# EAGLE schematic ece411_t2_schematic (EAGLE 9.5.2)
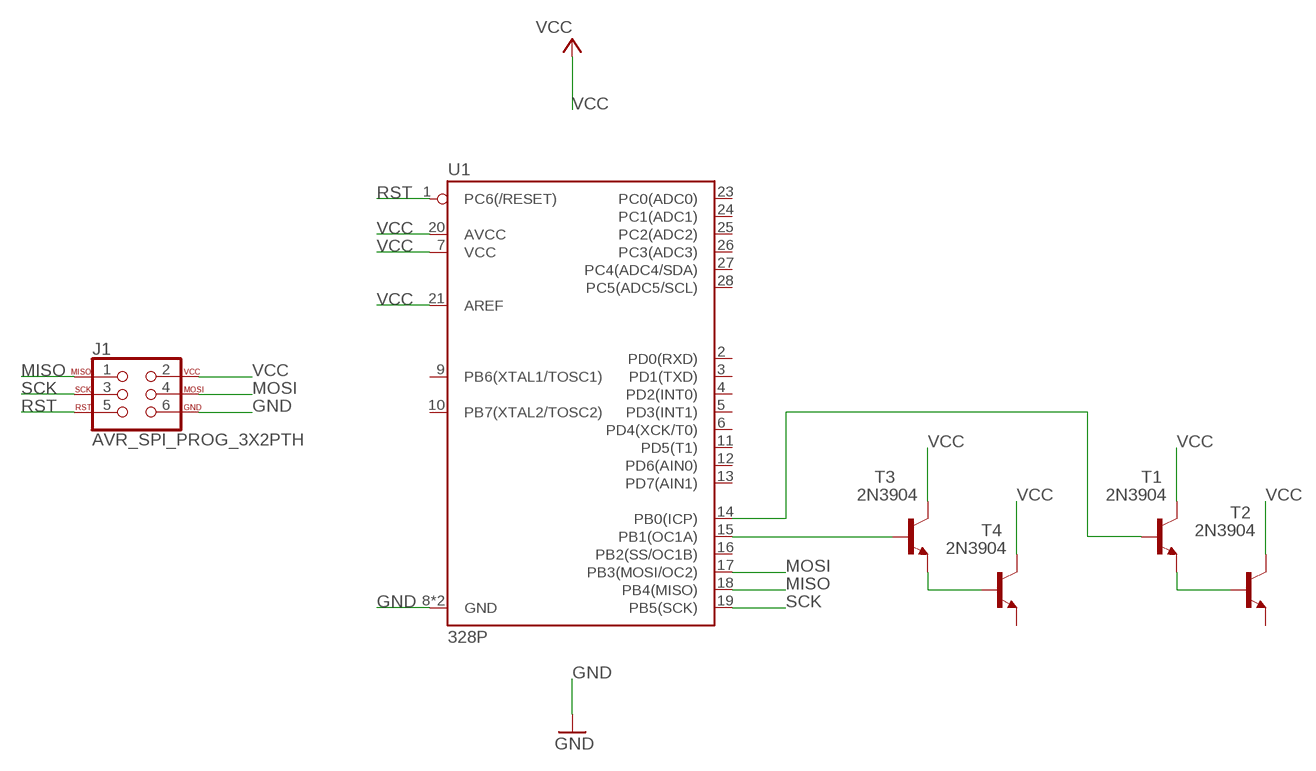
[diagram p0: schematic, sheet 1]

## Parts
J1  AVR_SPI_PROG_3X2PTH  [2X3]
T1  2N3904  [TO92]
T2  2N3904  [TO92]
T3  2N3904  [TO92]
T4  2N3904  [TO92]
U1  328P  ATMEGA328P_PDIP  [DIP28]

## Nets
GND: J1.6 U1.8(GND) U1.22(GND)
MISO: J1.1 U1.18(PB4(MISO))
MOSI: J1.4 U1.17(PB3(MOSI/OC2))
N$3: T1.2(B) U1.14(PB0(ICP))
N$4: T1.3(E) T2.2(B)
N$5: T3.2(B) U1.15(PB1(OC1A))
N$6: T3.3(E) T4.2(B)
RST: J1.5 U1.1(PC6(/RESET))
SCK: J1.3 U1.19(PB5(SCK))
VCC: J1.2 T1.1(C) T2.1(C) T3.1(C) T4.1(C) U1.7(VCC) U1.20(AVCC) U1.21(AREF)
Unconnected: T2.3(E) T4.3(E) U1.2(PD0(RXD)) U1.3(PD1(TXD)) U1.4(PD2(INT0)) U1.5(PD3(INT1)) U1.6(PD4(XCK/T0)) U1.9(PB6(XTAL1/TOSC1)) U1.10(PB7(XTAL2/TOSC2)) U1.11(PD5(T1)) U1.12(PD6(AIN0)) U1.13(PD7(AIN1)) U1.16(PB2(SS/OC1B)) U1.23(PC0(ADC0)) U1.24(PC1(ADC1)) U1.25(PC2(ADC2)) U1.26(PC3(ADC3)) U1.27(PC4(ADC4/SDA)) U1.28(PC5(ADC5/SCL))

## Library data of the parts
J1 = SparkFun-Connectors:AVR_SPI_PROG_3X2: AVR ISP 6 Pin This is the reduced ISP connector for AVR programming. Common on Arduino. This footprint will take up less PCB space and can be used with a 10-pin to 6-pin adapter such as SKU: BOB-08508 **Special note about "TEST_POINT" package. The stop mask is on the top side, so if you want your programming test points to be on the bottom of your board, make sure to place this package on the bottom side of the board. This also ensure that the orientation to program from the bottom side will be correct. SparkFun Products: SparkFun ISP Pogo Adapter <https://www.sparkfun.com/products/11591> - NS Tiny AVR Programmer <https://www.sparkfun.com/products/11801> -PTH
T1-T4 = transistor:2N3904: NPN TRANSISTOR
U1 = SparkFun-IC-Microcontroller:ATMEGA328P_PDIP: Atmel 328P Through hole ATMEGA328P uC used in the Arduino 32kb flash, 1k EEPROM, 2k SRAM Datasheet <http://www.sparkfun.com/datasheets/Components/SMD/ATMega328.pdf> SparkFun Products Storefront component: AVR 28 Pin 20MHz 32K 6A/D - ATMega328P <https://www.sparkfun.com/products/9061> (COM-09061) SparkFun Simon Says - Through-Hole Soldering Kit <https://www.sparkfun.com/products/10547> (KIT-10547) SparkFun Learn to Solder - Simon Says <https://www.sparkfun.com/products/13708> (KIT-13708) SparkFun BigTime Watch Kit <https://www.sparkfun.com/products/11734> (KIT-11734) SparkFun ClockIt <https://www.sparkfun.com/products/10930> (KIT-10930) SparkFun Serial Enabled LCD Kit <https://www.sparkfun.com/products/10097> (LCD-10097) SparkFun Simon Tilts - Through Hole Soldering Kit <https://www.sparkfun.com/products/12634> (KIT-12634) SparkFun Frequency Counter Kit <https://www.sparkfun.com/products/10140> (KIT-10140) FabFM Radio Kit <https://www.sparkfun.com/products/11043> (KIT-11043) SparkFun Binary Blaster Kit <https://www.sparkfun.com/products/12037> (KIT-12037) SparkFun Metro-Gnome <https://www.sparkfun.com/products/9236> (KIT-09236) ATmega328 with Arduino Optiboot (Uno) <https://www.sparkfun.com/products/10524> (DEV-10524); PROD_ID: IC-09136